# EAGLE schematic DISPLAY (EAGLE 7.2.0)
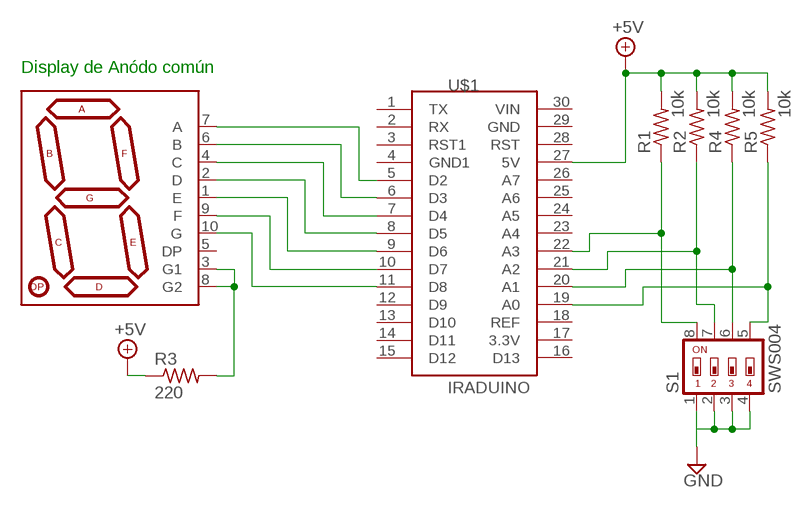
[diagram p0: schematic, sheet 1]

## Parts
R1  10k  R-US_0207/10  [0207/10]
R2  10k  R-US_0207/10  [0207/10]
R3  220  R-US_0207/10  [0207/10]
R4  10k  R-US_0207/10  [0207/10]
R5  10k  R-US_0207/10  [0207/10]
S1  SWS004  [SMS-004]
U$1  IRADUINO  [IRADUINO]
U$2  7-SEGMENT-DISPLAYPTH  [7-SEGMENT-DISPLAY]

## Nets
+5V: R1.2 R2.2 R3.1 R4.2 R5.2 U$1.27(5V)
GND: S1.1 S1.2 S1.3 S1.4
N$1: R3.2 U$2.3(G1) U$2.8(G2)
N$2: U$1.5(D2) U$2.7(A)
N$3: U$1.6(D3) U$2.6(B)
N$4: U$1.7(D4) U$2.4(C)
N$5: U$1.8(D5) U$2.2(D)
N$6: U$1.9(D6) U$2.1(E)
N$7: U$1.10(D7) U$2.9(F)
N$8: U$1.11(D8) U$2.10(G)
N$9: R1.1 S1.8 U$1.22(A3)
N$10: R2.1 S1.7 U$1.21(A2)
N$11: R4.1 S1.6 U$1.20(A1)
N$12: R5.1 S1.5 U$1.19(A0)
Unconnected: U$1.1(TX) U$1.2(RX) U$1.3(RST1) U$1.4(GND1) U$1.12(D9) U$1.13(D10) U$1.14(D11) U$1.15(D12) U$1.16(D13) U$1.17(3.3V) U$1.18(REF) U$1.23(A4) U$1.24(A5) U$1.25(A6) U$1.26(A7) U$1.28(RST) U$1.29(GND) U$1.30(VIN) U$2.5(DP)

## Notes on the sheet
- Display de Anódo común

## Library data of the parts
R1-R5 = rcl:R-US_: RESISTOR, American symbol
S1 = smd-special:SWS004: SMD Dip Switch 4 pol.
U$1 = IRADUINO:IRADUINO
U$2 = SparkFun:7-SEGMENT-DISPLAY